# EAGLE schematic WeatherStation (EAGLE 9.7.0)
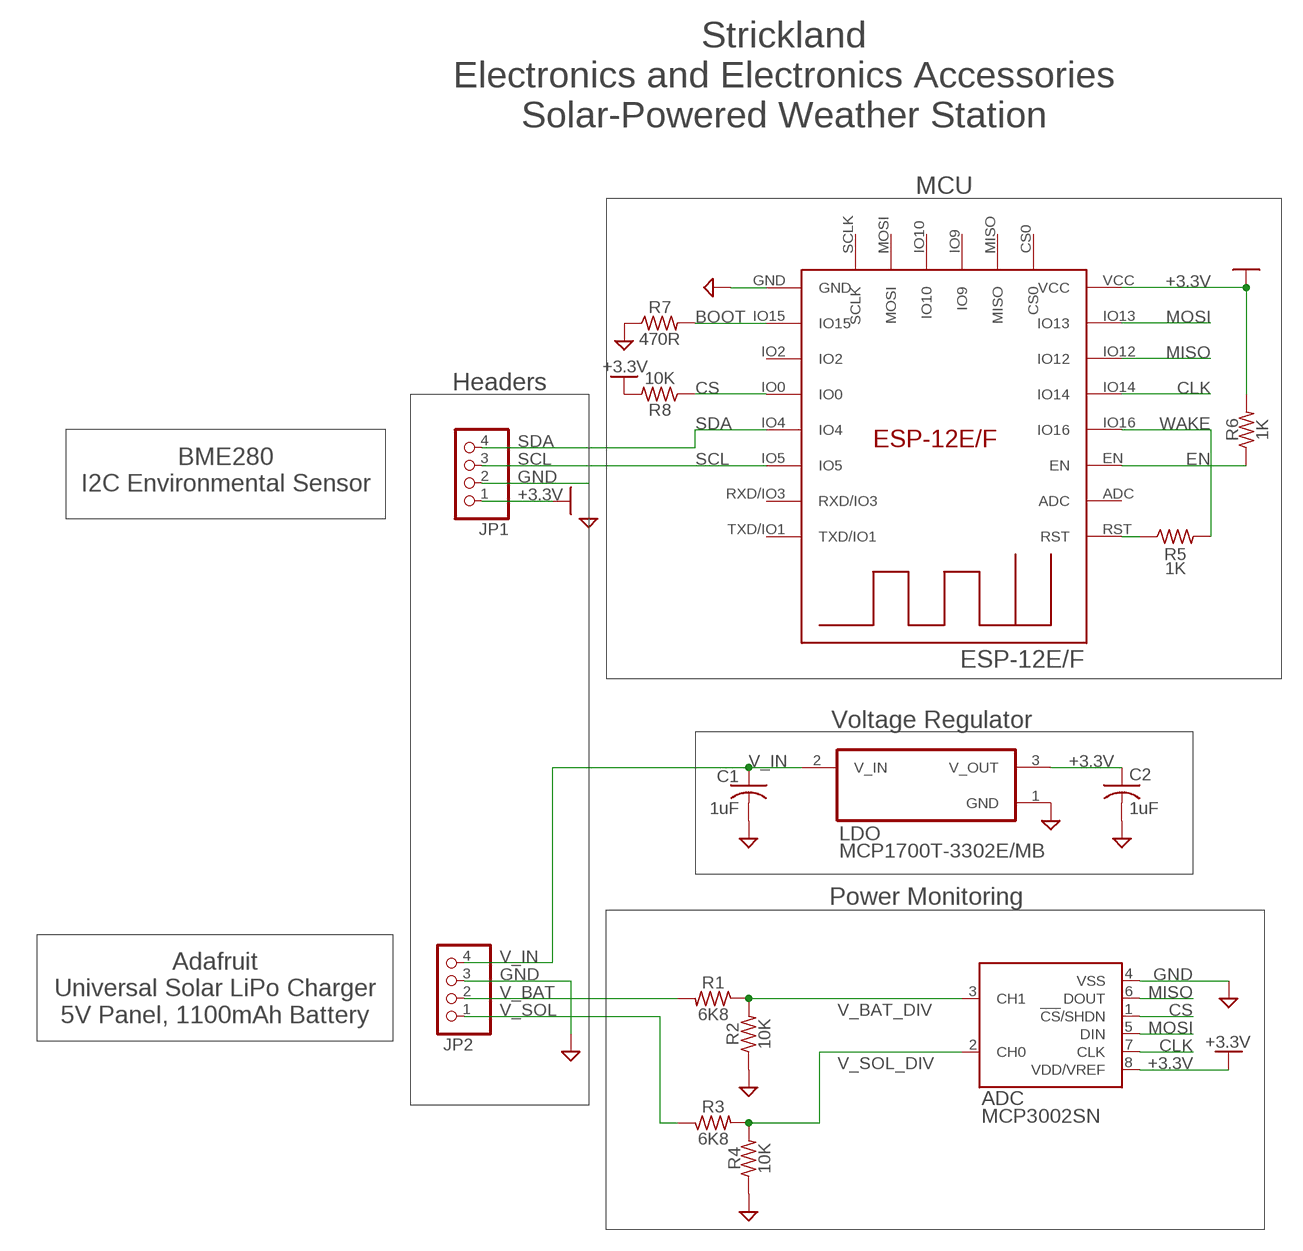
[diagram p0: schematic, sheet 1]

## Parts
ADC  MCP3002SN  [SO-08]
C1  1uF  C-US_CHIP-0805(2012-METRIC)  [CAPC2012X110]
C2  1uF  C-US_CHIP-0805(2012-METRIC)  [CAPC2012X110]
IC1  ESP-12E/F  [ESP-12E]
JP1  PINHD-1X4  [1X04]
JP2  PINHD-1X4/90  [1X04/90]
LDO  MCP1700T-3302E/MB  [REG-MCP1700TA-4P6X2P6-3SM-H1P6]
R1  6K8  R-US_CHIP-0805(2012-METRIC)  [RESC2012X65]
R2  10K  R-US_CHIP-0805(2012-METRIC)  [RESC2012X65]
R3  6K8  R-US_CHIP-0805(2012-METRIC)  [RESC2012X65]
R4  10K  R-US_CHIP-0805(2012-METRIC)  [RESC2012X65]
R5  1K  R-US_CHIP-0805(2012-METRIC)  [RESC2012X65]
R6  1K  R-US_CHIP-0805(2012-METRIC)  [RESC2012X65]
R7  470R  R-US_CHIP-0805(2012-METRIC)  [RESC2012X65]
R8  10K  R-US_CHIP-0805(2012-METRIC)  [RESC2012X65]

## Nets
+3.3V: ADC.8(VDD/VREF) C2.1 IC1.VCC JP1.1 LDO.3(V_OUT) R6.2 R8.2
BOOT: IC1.IO15 R7.2
CLK: ADC.7(CLK) IC1.IO14
CS: ADC.1(!CS!/SHDN) IC1.IO0 R8.1
EN: IC1.EN R6.1
GND: ADC.4(VSS) C1.2 C2.2 IC1.GND JP1.2 JP2.3 LDO.1(GND) R2.1 R4.1 R7.1
MISO: ADC.6(DOUT) IC1.IO12
MOSI: ADC.5(DIN) IC1.IO13
RST: IC1.RST R5.1
SCL: IC1.IO5 JP1.3
SDA: IC1.IO4 JP1.4
V_BAT: JP2.2 R1.2
V_BAT_DIV: ADC.3(CH1) R1.1 R2.2
V_IN: C1.1 JP2.4 LDO.2(V_IN)
V_SOL: JP2.1 R3.1
V_SOL_DIV: ADC.2(CH0) R3.2 R4.2
WAKE: IC1.IO16 R5.2
Unconnected: IC1.ADC IC1.CS0 IC1.IO2 IC1.IO9 IC1.IO10 IC1.MISO IC1.MOSI IC1.RXD/IO3 IC1.SCLK IC1.TXD/IO1

## Notes on the sheet
- Strickland
  Electronics and Electronics Accessories
  Solar-Powered Weather Station
- MCU
- Headers
- BME280
  I2C Environmental Sensor
- Voltage Regulator
- Power Monitoring
- Adafruit
  Universal Solar LiPo Charger
  5V Panel, 1100mAh Battery

## Library data of the parts
ADC = microchip:MCP3002: 2.7V Dual Channel 10-Bit A/D Converter with SPI Serial Interface Source: https://ww1.microchip.com/downloads/en/DeviceDoc/21294E.pdf; MF: MICROCHIP; MPN: MCP3202-CI/SN; OC_FARNELL: 1196803; OC_NEWARK: 19C7207; SPICEPREFIX: X
C1 C2 = Capacitor:C-US: Capacitor - ANSI; CATEGORY: Capacitor
IC1 = esp-12e-f:ESP-12E/F
JP1 JP2 = jumper_resilkscreen:PINHD-1X4: PIN HEADER; CATEGORY: CONNECTOR; SUB-CATEGORY: PIN-HEADER
LDO = MCP1700T-3302E_MB:MCP1700T-3302E/MB: None; MANUFACTURER: Microchip; PACKAGE: REG-MCP1700TA-4P6X2P6-3SM-H1P6
R1-R8 = Resistor:R-US: Resistor Fixed - ANSI; CATEGORY: Resistor; SUB-CATEGORY: Fixed

## Module SOLAR_LIPO_CHARGER
Ports: 

### Library data of the parts